# Altium schematic sheet [05] Algorytm.SchDoc
size 330 x 127 mm
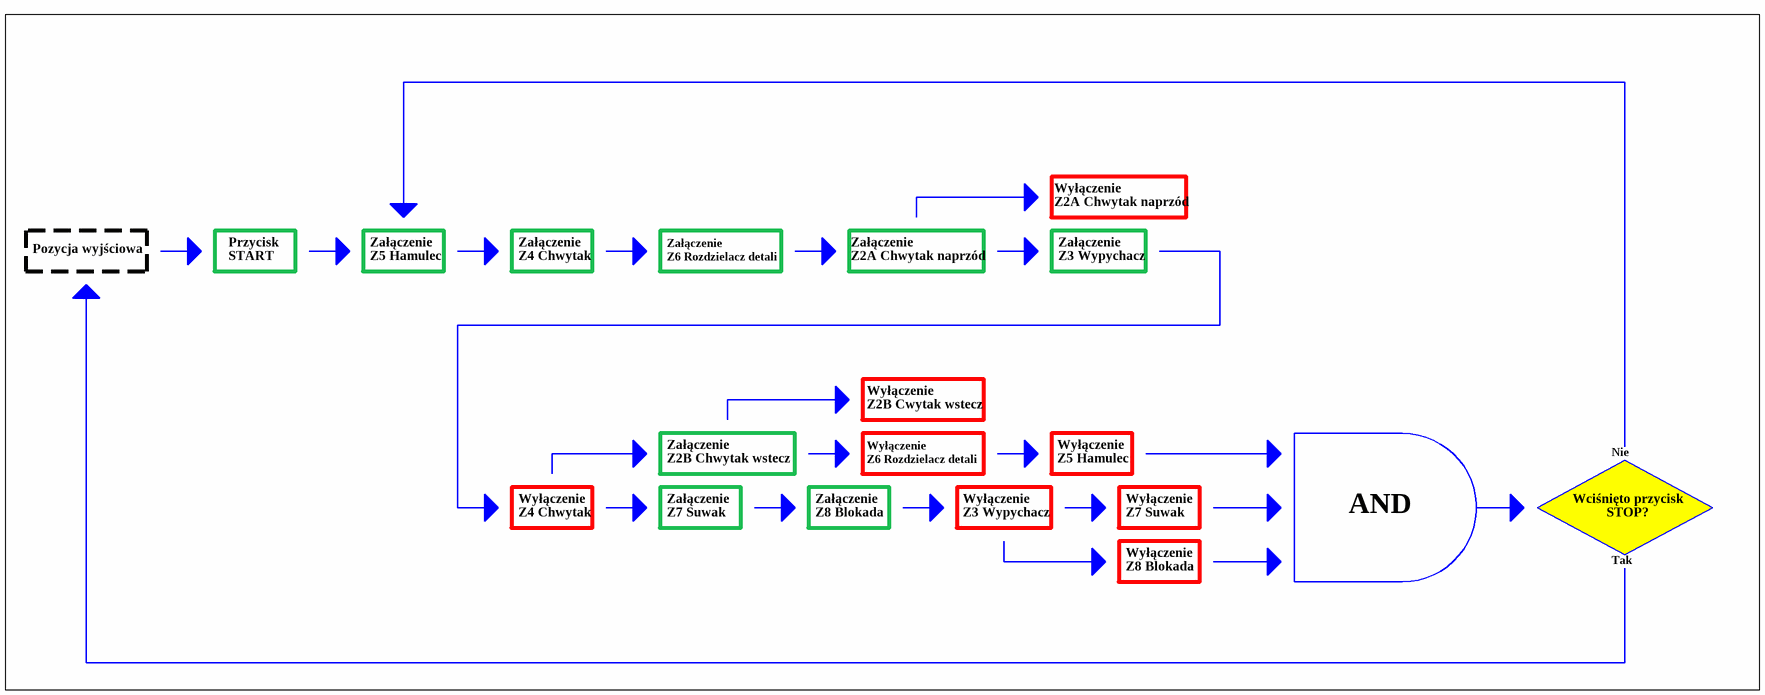
[diagram p0: [05] Algorytm.SchDoc]

## Notes on the sheet
- Wyłączenie
- Z2A Chwytak naprzód
- Pozycja wyjściowa
- Przycisk
- START
- Załączenie
- Z5 Hamulec
- Z4 Chwytak
- Z6 Rozdzielacz detali
- Z3 Wypychacz
- Z2B Cwytak wstecz
- Z2B Chwytak wstecz
- Wciśnięto przycisk
- Nie
- Z7 Suwak
- Z8 Blokada
- AND
- STOP?
- Tak